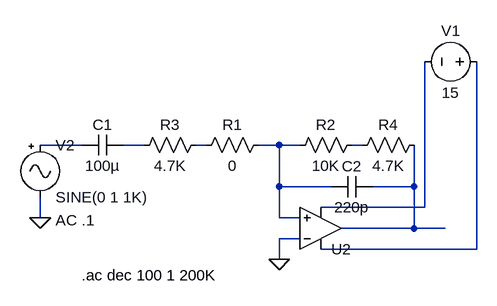
[diagram p0: schematic variable gain.asc]
variable gain.asc, the LTspice schematic file:
Version 4.1
SHEET 1 880 680
WIRE -96 112 -160 112
WIRE 0 112 -32 112
WIRE 96 112 80 112
WIRE 208 112 176 112
WIRE 240 112 208 112
WIRE 336 112 320 112
WIRE 208 176 208 112
WIRE 288 176 208 176
WIRE 416 176 416 112
WIRE 416 176 352 176
WIRE 432 208 432 -16
WIRE 432 208 272 208
WIRE -160 224 -160 192
WIRE 208 224 208 176
WIRE 240 224 208 224
WIRE 416 240 416 176
WIRE 416 240 304 240
WIRE 464 240 416 240
WIRE 240 256 208 256
WIRE 512 272 512 -16
WIRE 512 272 272 272
WIRE 208 288 208 256
FLAG 208 288 0
FLAG -160 224 0
SYMBOL cap -32 96 R90
WINDOW 0 0 32 VBottom 2
WINDOW 3 32 32 VTop 2
SYMATTR InstName C1
SYMATTR Value 100µ
SYMBOL res 192 96 R90
WINDOW 0 0 56 VBottom 2
WINDOW 3 32 56 VTop 2
SYMATTR InstName R1
SYMATTR Value 0
SYMBOL res 336 96 R90
WINDOW 0 0 56 VBottom 2
WINDOW 3 32 56 VTop 2
SYMATTR InstName R2
SYMATTR Value 10K
SYMBOL voltage 528 -16 R90
WINDOW 0 -32 56 VBottom 2
WINDOW 3 32 56 VTop 2
SYMATTR InstName V1
SYMATTR Value 15
SYMBOL res 96 96 R90
WINDOW 0 0 56 VBottom 2
WINDOW 3 32 56 VTop 2
SYMATTR InstName R3
SYMATTR Value 4.7K
SYMBOL res 432 96 R90
WINDOW 0 0 56 VBottom 2
WINDOW 3 32 56 VTop 2
SYMATTR InstName R4
SYMATTR Value 4.7K
SYMBOL Misc\\signal -160 96 R0
WINDOW 123 24 132 Left 2
WINDOW 39 0 0 Left 0
SYMATTR Value2 AC .1
SYMATTR InstName V2
SYMBOL cap 352 160 R90
WINDOW 0 0 32 VBottom 2
WINDOW 3 32 32 VTop 2
SYMATTR InstName C2
SYMATTR Value 220p
SYMBOL OpAmps\\UniversalOpAmp2 272 240 M180
SYMATTR InstName U2
TEXT -96 312 Left 2 !.ac dec 100 1 200K

The netlist it stands for:
* variable gain.asc
C1 N002 N001 100µ
R1 N004 N003 0
R2 N005 N004 10K
V1 N008 N007 15
R3 N003 N002 4.7K
R4 N006 N005 4.7K
V2 N001 0 SINE(0 1 1K) AC .1
C2 N006 N004 220p
X§U2 N004 0 N008 N007 N006 level2 Avol=1Meg GBW=10Meg Slew=10Meg Ilimit=25m Rail=0 Vos=0 En=0 Enk=0 In=0 Ink=0 Rin=500Meg  ; pins In+ In- V+ V- OUT
.ac dec 100 1 200K
.lib UniversalOpAmp2.lib
.backanno
.end